# Altium schematic sheet Power.SchDoc
size A4
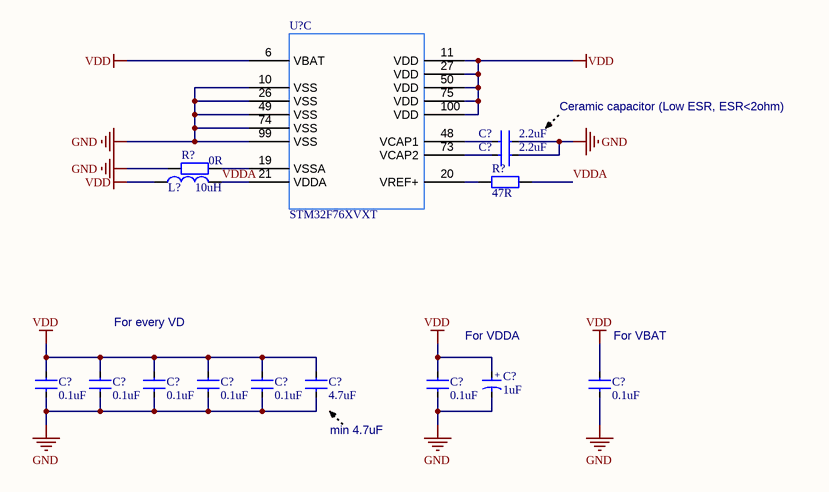
[diagram p0: Power.SchDoc]

## Parts
(Parts that share a designator on the sheet are numbered #1, #2 ... from top to bottom, then left to right.)
C?#1  2.2uF  [0805C]
C?#2  2.2uF  [0805C]
C?#3  1uF  [T-A-3216]
C?#4  0.1uF  [0603C_B]
C?#5  0.1uF  [0603C_B]
C?#6  0.1uF  [0603C_B]
C?#7  0.1uF  [0603C_B]
C?#8  0.1uF  [0603C_B]
C?#9  4.7uF  [0603C_B]
C?#10  0.1uF  [0603C_B]
C?#11  0.1uF  [0603C_B]
L?  10uH  [0805R]
R?#1  0R  [0603R_B]
R?#2  47R  [0603R_B]
U?  STM32F76XVXT  [LQFP-100_14X14mm]  (part C of 3)

## Nets
GND: C?#1.2 C?#2.2 C?#3.2 C?#4.2 C?#5.2 C?#6.2 C?#7.2 C?#8.2 C?#9.2 C?#10.2 C?#11.2 R?#1.1 U?.10(VSS) U?.26(VSS) U?.49(VSS) U?.74(VSS) U?.99(VSS)
VDD: C?#3.1 C?#4.1 C?#5.1 C?#6.1 C?#7.1 C?#8.1 C?#9.1 C?#10.1 C?#11.1 L?.2 U?.6(VBAT) U?.11(VDD) U?.27(VDD) U?.50(VDD) U?.75(VDD) U?.100(VDD)
VDDA: L?.1 R?#2.2 U?.21(VDDA)
NetC?#1_1: C?#1.1 U?.48(VCAP1)
NetC?#2_1: C?#2.1 U?.73(VCAP2)
NetR?#1_2: R?#1.2 U?.19(VSSA)
NetR?#2_1: R?#2.1 U?.20(VREF+)

## Notes on the sheet
- Ceramic capacitor (Low ESR, ESR<2ohm)
- (near C?#6) For every VD
- (near C?#3) For VDDA
- (near C?#11) For VBAT
- (near C?#9) min 4.7uF
- (in symbol CAP-T) +

## Library data of the parts
C?#1 C?#2 C?#4-C?#11 = CAP: 普通小电容
  C?#1 C?#2: Value: 2.2uF
  C?#4-C?#8 C?#10 C?#11: Value: 0.1uF
  C?#9: Value: 4.7uF
C?#3 = CAP-T: 钽电容; Value: 1uF
L? = L1: 普通电感; Value: 10uH
R?#1 R?#2 = RES: 普通电阻
  R?#1: Value: 0R
  R?#2: Value: 47R
U? = STM32F76XVXT: Imported; Vendor: STMicroelectronics; C: Copyright (C) 2016 Accelerated Designs. All rights reserved; Manufacturer_Part_Number: stm32f76xvxt; Copyright: Copyright (C) 2016 Accelerated Designs. All rights reserved; RefDes: RefDes; Type: Type; Value: Value